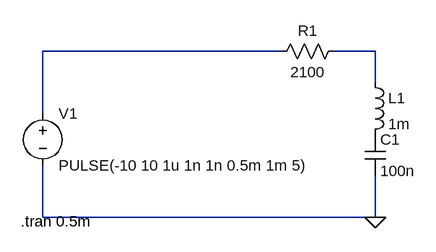
[diagram p0: schematic Task1.asc]
Task1.asc, the LTspice schematic file:
Version 4
SHEET 1 880 680
WIRE 144 64 -224 64
WIRE 288 64 224 64
WIRE 288 112 288 64
WIRE -224 160 -224 64
WIRE -224 320 -224 240
WIRE 288 320 288 256
WIRE 288 320 -224 320
FLAG 288 320 0
SYMBOL voltage -224 144 R0
WINDOW 123 0 0 Left 0
WINDOW 39 0 0 Left 0
SYMATTR InstName V1
SYMATTR Value PULSE(-10 10 1u 1n 1n 0.5m 1m 5)
SYMBOL res 240 48 R90
WINDOW 0 0 56 VBottom 2
WINDOW 3 32 56 VTop 2
SYMATTR InstName R1
SYMATTR Value 2100
SYMBOL ind 272 96 R0
SYMATTR InstName L1
SYMATTR Value 1m
SYMATTR SpiceLine Rser=2.8
SYMBOL cap 272 192 R0
SYMATTR InstName C1
SYMATTR Value 100n
TEXT -258 326 Left 2 !.tran 0.5m

The netlist it stands for:
* Task1.asc
V1 N001 0 PULSE(-10 10 1u 1n 1n 0.5m 1m 5)
R1 N002 N001 2100
L1 N002 P001 1m Rser=2.8
C1 P001 0 100n
.tran 0.5m
.backanno
.end